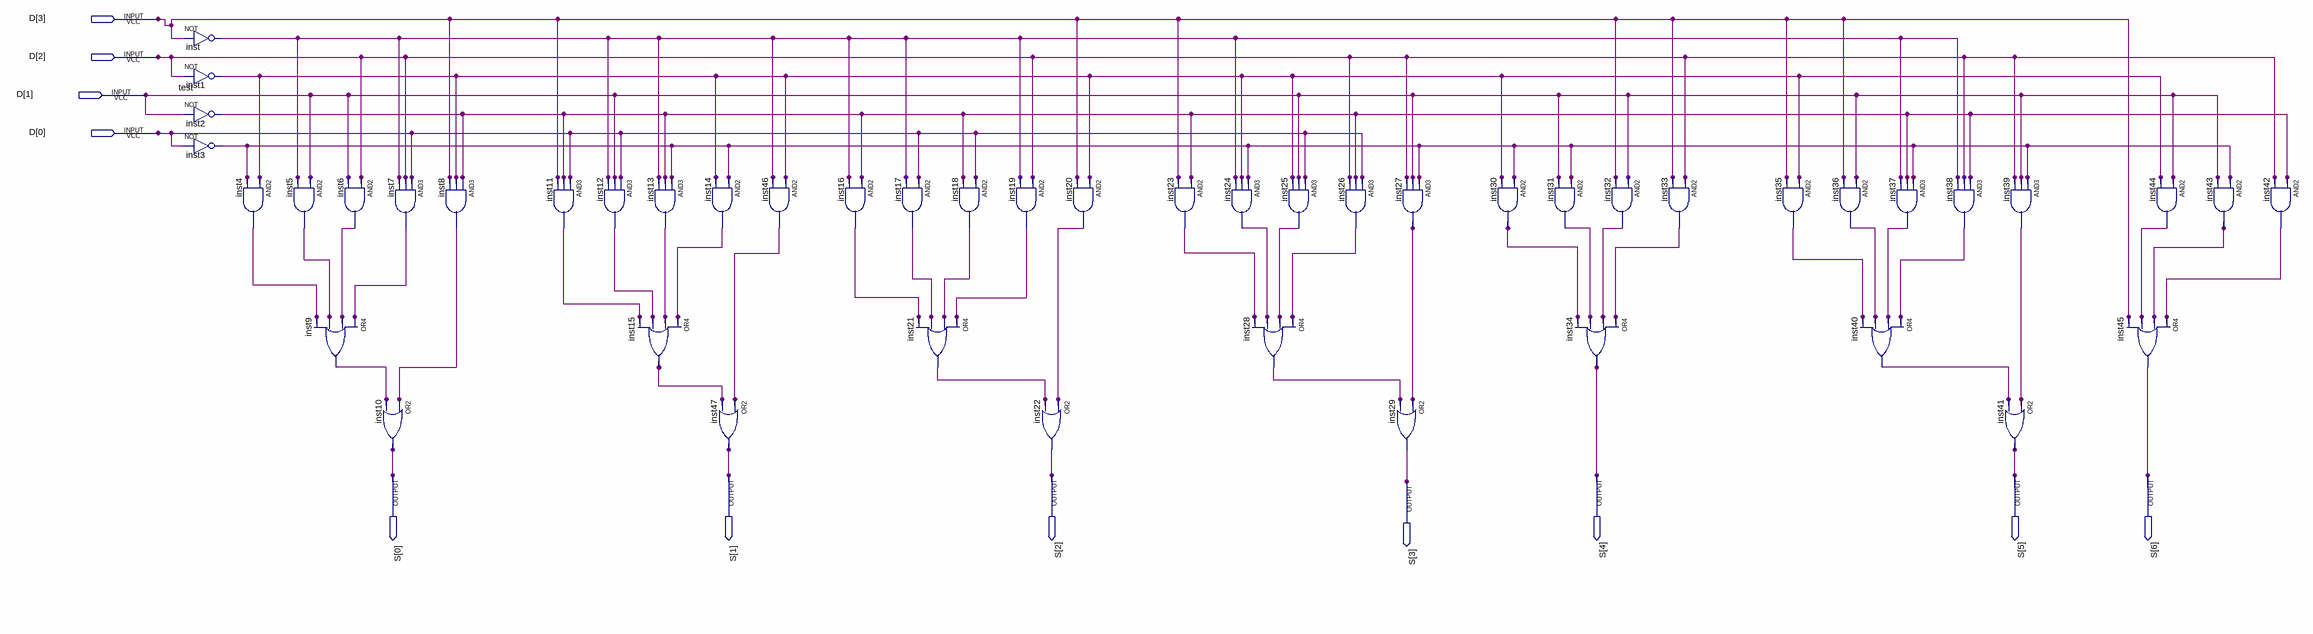
[diagram p0: schematic sheet]
// Quartus schematic project02_la.bdf as structural Verilog: 48 symbols, 11 pins
module project02_la (
  input  [3:0] D,
  output [6:0] S
);

  wire inst1_out, inst2_out, inst3_out, inst4_out, inst5_out, inst6_out, inst7_out, inst8_out, inst9_out,
       inst11_out, inst12_out, inst13_out, inst14_out, inst15_out, inst16_out, inst17_out, inst18_out,
       inst19_out, inst20_out, inst21_out, inst23_out, inst24_out, inst25_out, inst26_out, inst27_out,
       inst28_out, inst30_out, inst31_out, inst32_out, inst33_out, inst35_out, inst36_out, inst37_out,
       inst38_out, inst39_out, inst40_out, inst42_out, inst43_out, inst44_out, inst46_out, inst_out;

  not inst (inst_out, D[3]);
  not inst1 (inst1_out, D[2]);
  not inst2 (inst2_out, D[1]);
  not inst3 (inst3_out, D[0]);
  and inst4 (inst4_out, inst1_out, inst3_out);
  and inst5 (inst5_out, D[1], inst_out);
  and inst6 (inst6_out, D[2], D[1]);
  or inst9 (inst9_out, inst7_out, inst6_out, inst5_out, inst4_out);
  and inst7 (inst7_out, D[0], D[2], inst_out);
  or inst10 (S[0], inst8_out, inst9_out);
  and inst8 (inst8_out, inst2_out, inst1_out, D[3]);
  and inst11 (inst11_out, D[0], inst2_out, D[3]);
  and inst12 (inst12_out, D[0], D[1], inst_out);
  or inst15 (inst15_out, inst14_out, inst13_out, inst12_out, inst11_out);
  and inst13 (inst13_out, inst3_out, inst2_out, inst_out);
  and inst14 (inst14_out, inst3_out, inst1_out);
  or inst47 (S[1], inst46_out, inst15_out);
  and inst46 (inst46_out, inst1_out, inst_out);
  and inst16 (inst16_out, inst2_out, inst_out);
  and inst17 (inst17_out, D[0], inst_out);
  or inst21 (inst21_out, inst19_out, inst18_out, inst17_out, inst16_out);
  and inst18 (inst18_out, D[0], inst2_out);
  and inst19 (inst19_out, D[2], inst_out);
  or inst22 (S[2], inst20_out, inst21_out);
  and inst20 (inst20_out, inst1_out, D[3]);
  and inst23 (inst23_out, inst2_out, D[3]);
  and inst24 (inst24_out, inst3_out, inst1_out, inst_out);
  or inst28 (inst28_out, inst26_out, inst25_out, inst24_out, inst23_out);
  and inst25 (inst25_out, D[0], D[1], inst1_out);
  and inst26 (inst26_out, D[0], inst2_out, D[2]);
  and inst27 (inst27_out, inst3_out, D[1], D[2]);
  or inst29 (S[3], inst27_out, inst28_out);
  and inst30 (inst30_out, inst3_out, inst1_out);
  and inst31 (inst31_out, inst3_out, D[1]);
  and inst32 (inst32_out, D[1], D[3]);
  or inst34 (S[4], inst33_out, inst32_out, inst31_out, inst30_out);
  and inst33 (inst33_out, D[2], D[3]);
  and inst35 (inst35_out, inst1_out, D[3]);
  and inst36 (inst36_out, D[1], D[3]);
  or inst40 (inst40_out, inst38_out, inst37_out, inst36_out, inst35_out);
  and inst37 (inst37_out, inst3_out, inst2_out, inst_out);
  and inst38 (inst38_out, inst2_out, D[2], inst_out);
  and inst39 (inst39_out, inst3_out, D[1], D[2]);
  or inst41 (S[5], inst39_out, inst40_out);
  and inst44 (inst44_out, D[1], inst1_out);
  or inst45 (S[6], inst42_out, inst43_out, inst44_out, D[3]);
  and inst43 (inst43_out, inst3_out, D[1]);
  and inst42 (inst42_out, inst2_out, D[2]);

  // Other names for the same wires on the sheet: test = D[1]
endmodule
